# EAGLE design BMC1 (EAGLE 7.6.0)
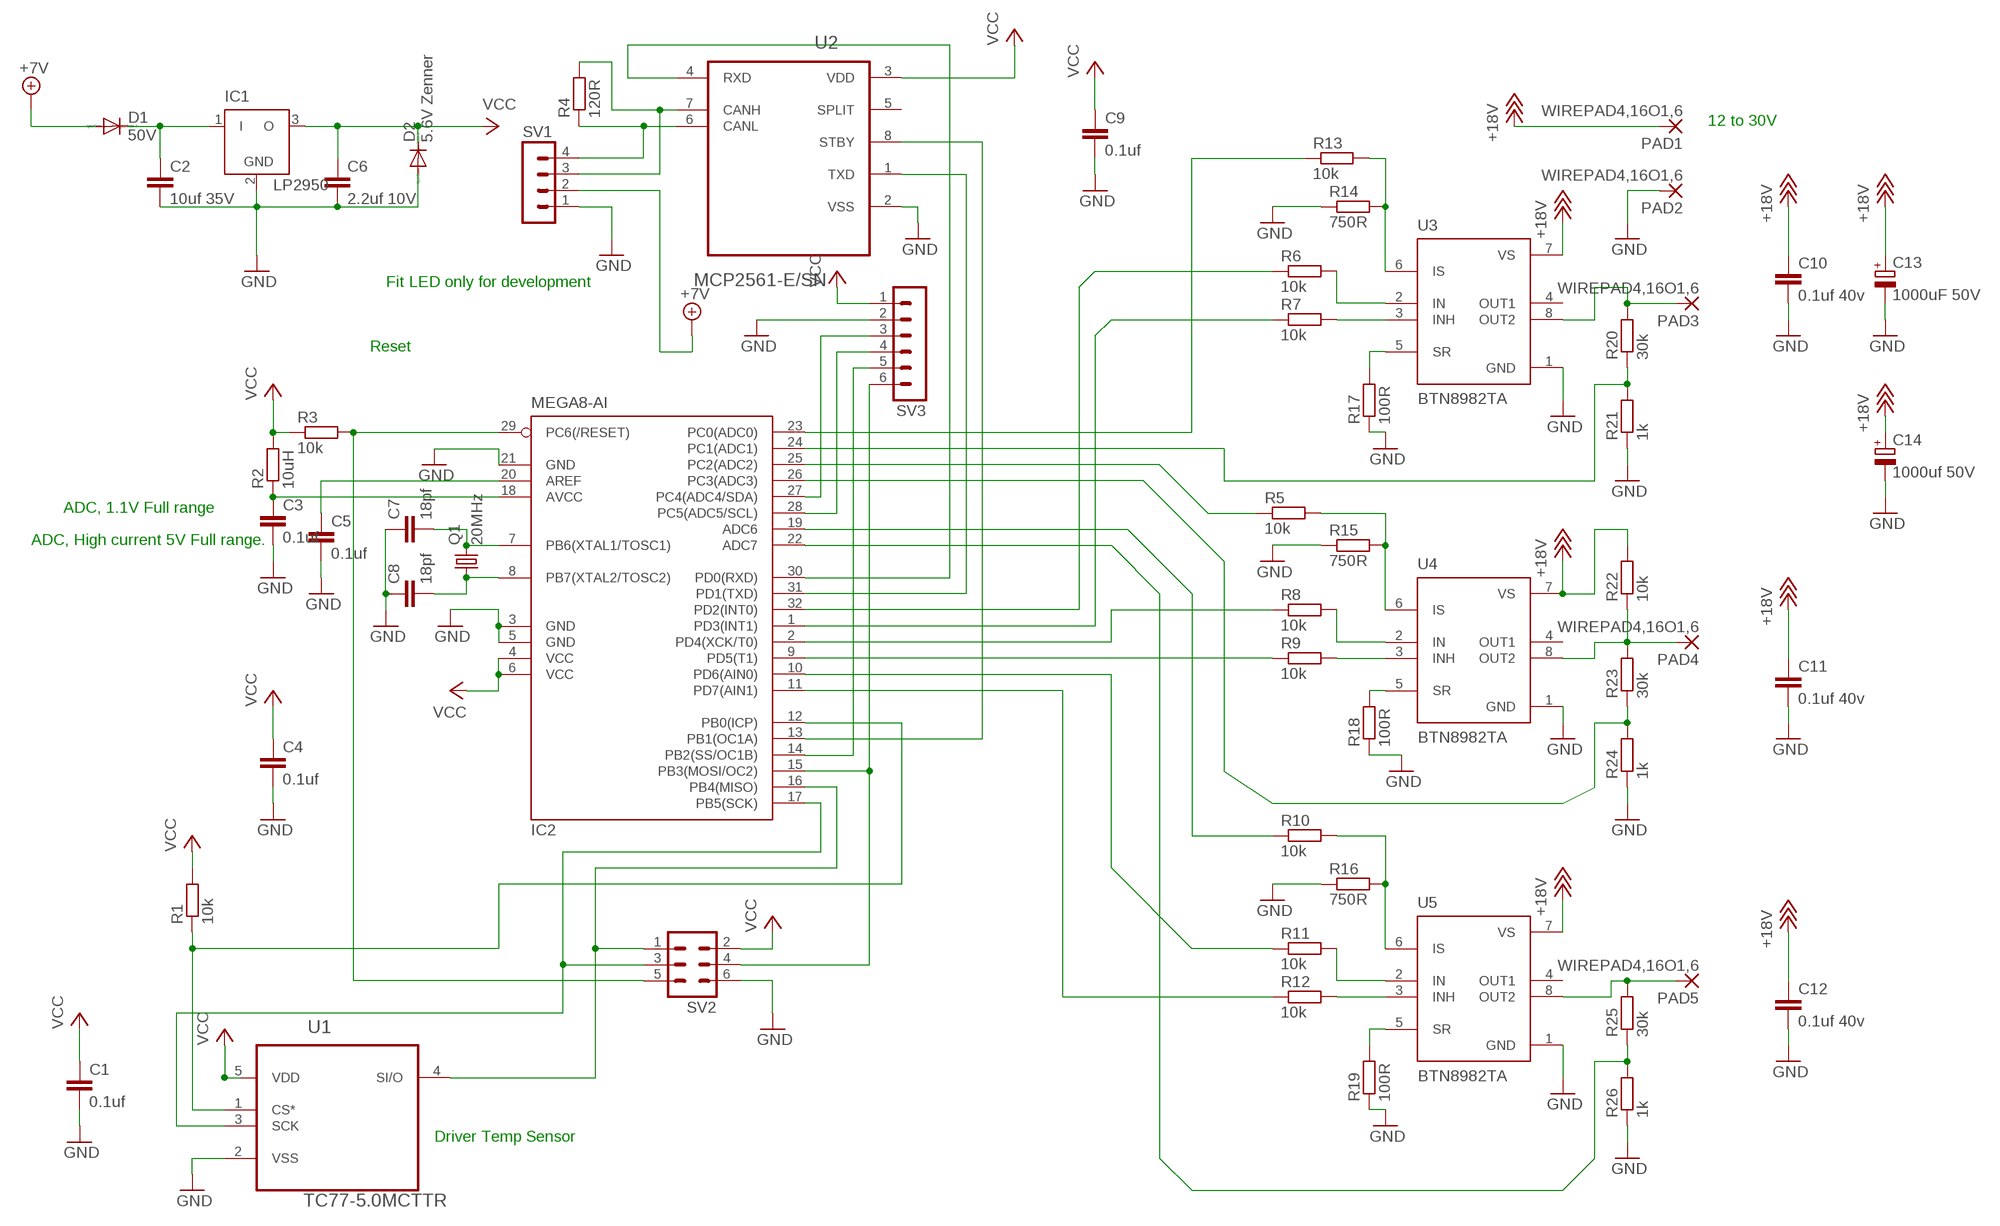
[diagram p0: schematic, sheet 1]

## Parts
C1  0.1uf  C-EUC0805  [C0805]
C2  10uf 35V  C-EUC0805  [C0805]
C3  0.1uf  C-EUC0805  [C0805]
C4  0.1uf  C-EUC0805  [C0805]
C5  0.1uf  C-EUC0805  [C0805]
C6  2.2uf 10V  C-EUC0805  [C0805]
C7  18pf  C-EUC0805  [C0805]
C8  18pf  C-EUC0805  [C0805]
C9  0.1uf  C-EUC0805  [C0805]
C10  0.1uf 40v  C-EUC0805  [C0805]
C11  0.1uf 40v  C-EUC0805  [C0805]
C12  0.1uf 40v  C-EUC0805  [C0805]
C13  1000uF 50V  CPOL-EUUD-10X10  [UD-10X10_NICHICON]
C14  1000uf 50V  CPOL-EUE5-10.5  [E5-10,5]
D1  50V  DIODE-SMB  [SMB]
D2  5.6V Zenner  DIODE-DO214AA  [DO214AA]
IC1  LP2950  [DPACK]
IC2  MEGA8-AI  [TQFP32-08]
PAD1  WIREPAD4,16O1,6  [4,16O1,6]
PAD2  WIREPAD4,16O1,6  [4,16O1,6]
PAD3  WIREPAD4,16O1,6  [4,16O1,6]
PAD4  WIREPAD4,16O1,6  [4,16O1,6]
PAD5  WIREPAD4,16O1,6  [4,16O1,6]
Q1  20MHz  CRYSTALHC49S  [HC49/S]
R1  10k  R-EU_R0805  [R0805]
R2  10uH  R-EU_R0805  [R0805]
R3  10k  R-EU_R0805  [R0805]
R4  120R  R-EU_R0805  [R0805]
R5  10k  R-EU_R0805  [R0805]
R6  10k  R-EU_R0805  [R0805]
R7  10k  R-EU_R0805  [R0805]
R8  10k  R-EU_R0805  [R0805]
R9  10k  R-EU_R0805  [R0805]
R10  10k  R-EU_R0805  [R0805]
R11  10k  R-EU_R0805  [R0805]
R12  10k  R-EU_R0805  [R0805]
R13  10k  R-EU_R0805  [R0805]
R14  750R  R-EU_R0805  [R0805]
R15  750R  R-EU_R0805  [R0805]
R16  750R  R-EU_R0805  [R0805]
R17  100R  R-EU_R0805  [R0805]
R18  100R  R-EU_R0805  [R0805]
R19  100R  R-EU_R0805  [R0805]
R20  30k  R-EU_R0805  [R0805]
R21  1k  R-EU_R0805  [R0805]
R22  10k  R-EU_R0805  [R0805]
R23  30k  R-EU_R0805  [R0805]
R24  1k  R-EU_R0805  [R0805]
R25  30k  R-EU_R0805  [R0805]
R26  1k  R-EU_R0805  [R0805]
SV1  MA04-1  [MA04-1]
SV2  MA03-2  [MA03-2]
SV3  MA06-1  [MA06-1]
U1  TC77-5.0MCTTR  [SOT95P290X145-5N]
U2  MCP2561-E/SN  [SOIC127P600X175-8N]
U3  BTN8982TA  [TO127P1500X440-8N-1]
U4  BTN8982TA  [TO127P1500X440-8N-1]
U5  BTN8982TA  [TO127P1500X440-8N-1]

## Nets
18V [power]: C10.1 C11.1 C12.1 C13.+ C14.+ PAD1.1(P) R22.2 U3.7(VS) U4.7(VS) U5.7(VS) ; supply symbol labelled +18V
+7V [supply]: D1.A SV1.2
GND [supply]: C1.2 C2.2 C3.2 C4.2 C5.2 C6.2 C7.1 C8.1 C9.2 C10.2 C11.2 C12.2 C13.- C14.- D2.A IC1.2(GND) IC2.3(GND) IC2.5(GND) IC2.21(GND) PAD2.1(P) R14.1 R15.1 R16.1 R17.1 R18.1 R19.1 R21.1 R24.1 R26.1 SV1.1 SV2.6 SV3.2 U1.2(VSS) U2.2(VSS) U3.1(GND) U4.1(GND) U5.1(GND)
N$1: R17.2 U3.5(SR)
N$2 [power]: PAD3.1(P) R20.2 U3.8(OUT2)
N$3: R7.2 U3.3(INH)
N$4: R6.2 U3.2(IN)
N$5: IC2.24(PC1(ADC1)) R20.1 R21.2
N$6: IC2.16(PB4(MISO)) SV2.1 U1.4(SI/O)
N$7 [power]: PAD4.1(P) R22.1 R23.2 U4.8(OUT2)
N$8: R18.2 U4.5(SR)
N$9: R9.2 U4.3(INH)
N$10: R8.2 U4.2(IN)
N$11: IC2.25(PC2(ADC2)) R5.1
N$12: IC2.2(PD4(XCK/T0)) R8.1
N$13 [power]: PAD5.1(P) R25.2 U5.8(OUT2)
N$14: R19.2 U5.5(SR)
N$15: R12.2 U5.3(INH)
N$16: R11.2 U5.2(IN)
N$17: IC2.19(ADC6) R10.1
N$18: IC2.22(ADC7) R25.1 R26.2
N$19: R4.1 SV1.4 U2.6(CANL)
N$21: IC2.9(PD5(T1)) R9.1
N$22: IC2.26(PC3(ADC3)) R23.1 R24.2
N$23: R4.2 SV1.3 U2.7(CANH)
N$25: IC2.13(PB1(OC1A)) U2.8(STBY)
N$26 [supply]: C2.1 D1.C IC1.1(I)
N$27: C7.2 IC2.7(PB6(XTAL1/TOSC1)) Q1.2
N$31: C8.2 IC2.8(PB7(XTAL2/TOSC2)) Q1.1
N$32: IC2.15(PB3(MOSI/OC2)) SV2.4 SV3.6
N$33: IC2.32(PD2(INT0)) R6.1
N$34: IC2.17(PB5(SCK)) SV2.3 U1.3(SCK)
N$36: R5.2 R15.2 U4.6(IS)
N$37: IC2.27(PC4(ADC4/SDA)) SV3.3
N$38: R13.2 R14.2 U3.6(IS)
N$39: R10.2 R16.2 U5.6(IS)
N$40: C3.1 IC2.18(AVCC) R2.1
N$41: IC2.28(PC5(ADC5/SCL)) SV3.4
N$42: IC2.30(PD0(RXD)) U2.4(RXD)
N$43: IC2.31(PD1(TXD)) U2.1(TXD)
N$44: IC2.11(PD7(AIN1)) R12.1
N$45: IC2.10(PD6(AIN0)) R11.1
N$46: IC2.1(PD3(INT1)) R7.1
N$49: IC2.14(PB2(SS/OC1B)) SV3.5
N$50: IC2.12(PB0(ICP)) R1.1 U1.1(CS*)
N$52: IC2.29(PC6(/RESET)) R3.2 SV2.5
N$54: C5.1 IC2.20(AREF)
N$55: IC2.23(PC0(ADC0)) R13.1
VCC [supply]: C1.1 C4.1 C6.1 C9.1 D2.C IC1.3(O) IC2.4(VCC) IC2.6(VCC) R1.2 R2.2 R3.1 SV2.2 SV3.1 U1.5(VDD) U2.3(VDD)
Unconnected: U2.5(SPLIT) U3.4(OUT1) U4.4(OUT1) U5.4(OUT1)

## Notes on the sheet
- 12 to 30V
- Fit LED only for development
- Reset
- ADC, 1.1V Full range
- ADC, High current 5V Full range.
- Driver Temp Sensor

## Library data of the parts
C1 C4 C9-C12 = rcl:C-EU: CAPACITOR, European symbol; MF: KEMET; MPN: C0805C104J5RACTU; OC_FARNELL: 1414663
C2 = rcl:C-EU: CAPACITOR, European symbol; MF: MURATA; MPN: GRM32ER7YA106KA12L; OC_FARNELL: 1735537
C3 C5 = rcl:C-EU: CAPACITOR, European symbol; MF: WALSIN; MPN: 0805B104K500CT; OC_FARNELL: 2496944
C6 = rcl:C-EU: CAPACITOR, European symbol; MF: KEMET; MPN: C0805C225K8RACAUTO; OC_FARNELL: 2478259
C7 C8 = rcl:C-EU: CAPACITOR, European symbol; MF: WALSIN; MPN: 0805N180J500CT; OC_FARNELL: 2497020
C13 = rcl:CPOL-EU: POLARIZED CAPACITOR, European symbol; MF: KEMET; MPN: T491A105K016AT; OC_FARNELL: 1457406
C14 = resistor:CPOL-EU: POLARIZED CAPACITOR, European symbol
D1 = diode:DIODE-: DIODE; MF: FAIRCHILD SEMICONDUCTOR; MPN: GF1A; OC_FARNELL: 1467476
D2 = diode:DIODE-: DIODE; MF: ON SEMICONDUCTOR; MPN: 1SMB5919BT3G; OC_FARNELL: 1431162
IC1 = linear:LP2950: 100 mA, Low Power Low Dropout Voltage Regulator Source: http://www.onsemi.com/pub/Collateral/LP2950-D.PDF; MF: ON SEMICONDUCTOR; MPN: LP2950CDT-5.0G; OC_FARNELL: 1468707
IC2 = atmel:MEGA8: MICROCONTROLLER 8 Kbytes FLASH, 1 kbytes SRAM, 512 bytes EEPROM, USART, 6-channel 10 bit ADC, 2-channel 8 bit ADC Pin compatible with Atmega48, ATMega88, ATMega168 Source: avr.lbr; MF: ATMEL; MPN: ATMEGA8-16AU; OC_FARNELL: 9171371; OC_NEWARK: 73M8863
PAD1-PAD5 = wirepad:WIREPAD: Wire PAD connect wire on PCB; OC_FARNELL: unknown
Q1 = crystal:CRYSTAL: CRYSTAL; MF: MULTICOMP; MPN: HC49SM-3.6864-30-50-60-16-ATF; OC_FARNELL: 1667008; OC_NEWARK: unknown
R1 R3 R5-R13 R22 = resistor:R-EU_: RESISTOR, European symbol; MF: WELWYN; MPN: WCR0805-10KFI; OC_FARNELL: 1099807
R2 = resistor:R-EU_: RESISTOR, European symbol; MF: TAIYO YUDEN; MPN: LB2012T100KR; OC_FARNELL: 1463501
R4 R14-R16 = resistor:R-EU_: RESISTOR, European symbol; MF: VISHAY; MPN: CRCW0805750RFKEA; OC_FARNELL: 1469956
R17-R19 = resistor:R-EU_: RESISTOR, European symbol; MF: WELWYN; MPN: WCR0805-100RFI; OC_FARNELL: 1099793
R20 R23 R25 = resistor:R-EU_: RESISTOR, European symbol; MF: VISHAY; MPN: CRCW080530K0FKEA; OC_FARNELL: 1469914
R21 R24 R26 = resistor:R-EU_: RESISTOR, European symbol; MF: VISHAY; MPN: CRCW08051K00FKEA; OC_FARNELL: 1469847
SV1 = con-lstb:MA04-1: PIN HEADER; OC_FARNELL: unknown; OC_NEWARK: unknown
SV2 = con-lstb:MA03-2: PIN HEADER; OC_FARNELL: unknown; OC_NEWARK: unknown
SV3 = con-lstb:MA06-1: PIN HEADER; OC_FARNELL: unknown; OC_NEWARK: unknown
U1 = temp-tc77-5v:TC77-5.0MCTTR: IC,Thermal Sensor with SPI Interface ,5.0V, SOT23-5; MF: MICROCHIP; MPN: TC77-5.0MCTTR; OC_FARNELL: 1292291; OC_NEWARK: 96K4049; PACKAGE: SOT23-5; SUPPLIER: Microchip
U2 = Microchip-MCP2561-E_SN:MCP2561-E/SN: High-Speed CAN Transceiver,SOIC-8; MPN: MCP2561-E/SN; OC_FARNELL: 2362837; OC_NEWARK: 12X8698; PACKAGE: SOIC-8; SUPPLIER: Microchip
U3-U5 = BTN8982TA:BTN8982TA: BTN8982TA High Current PN Half Bridge NovalithIC TO127P1500X440-8N-1; MF: INFINEON; MPN: BTN8982TA; OC_FARNELL: 2470127

## Net classes
0 default: width 0.203 mm, clearance 0.203 mm
1 supply: width 0.305 mm
2 power: width 0.914 mm, clearance 0.406 mm

## Board
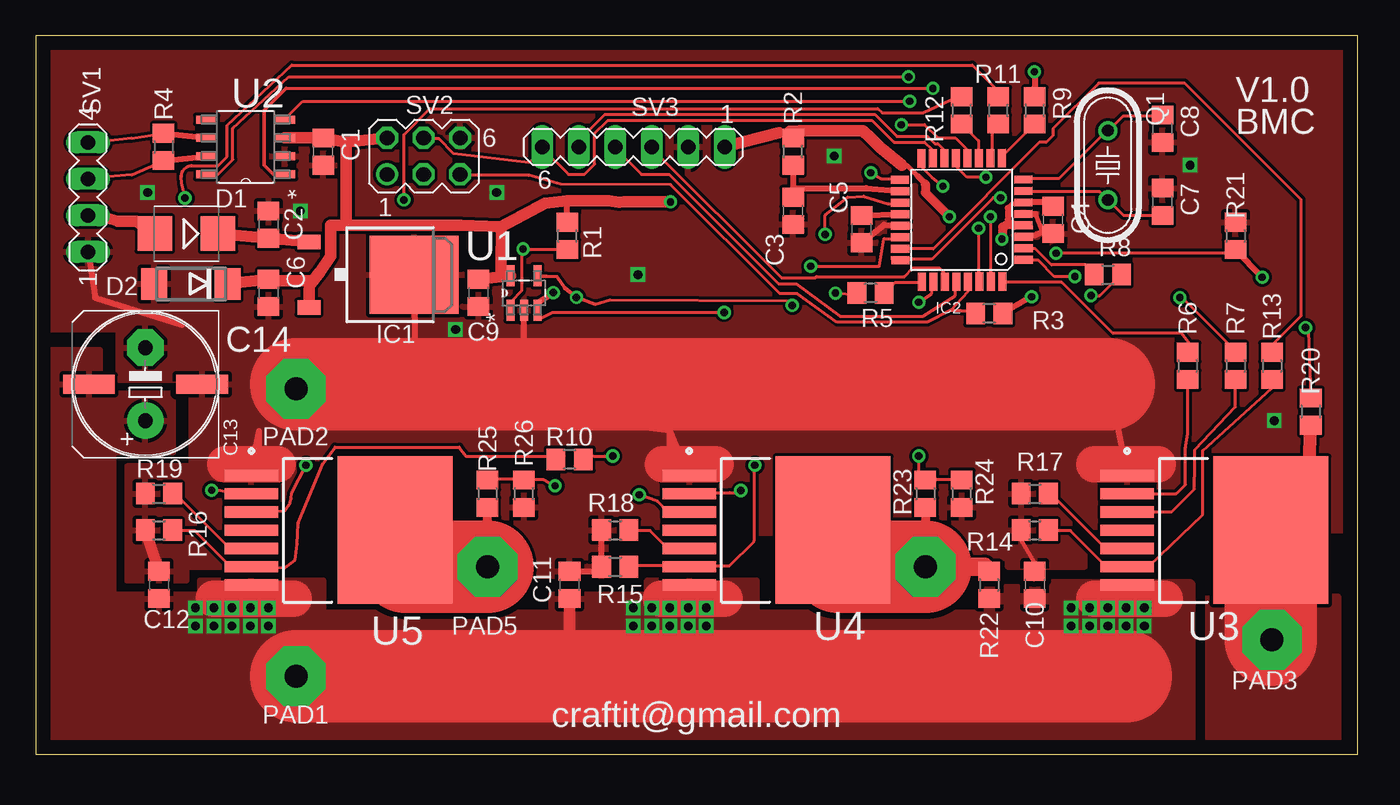
[diagram p1: board, top side]
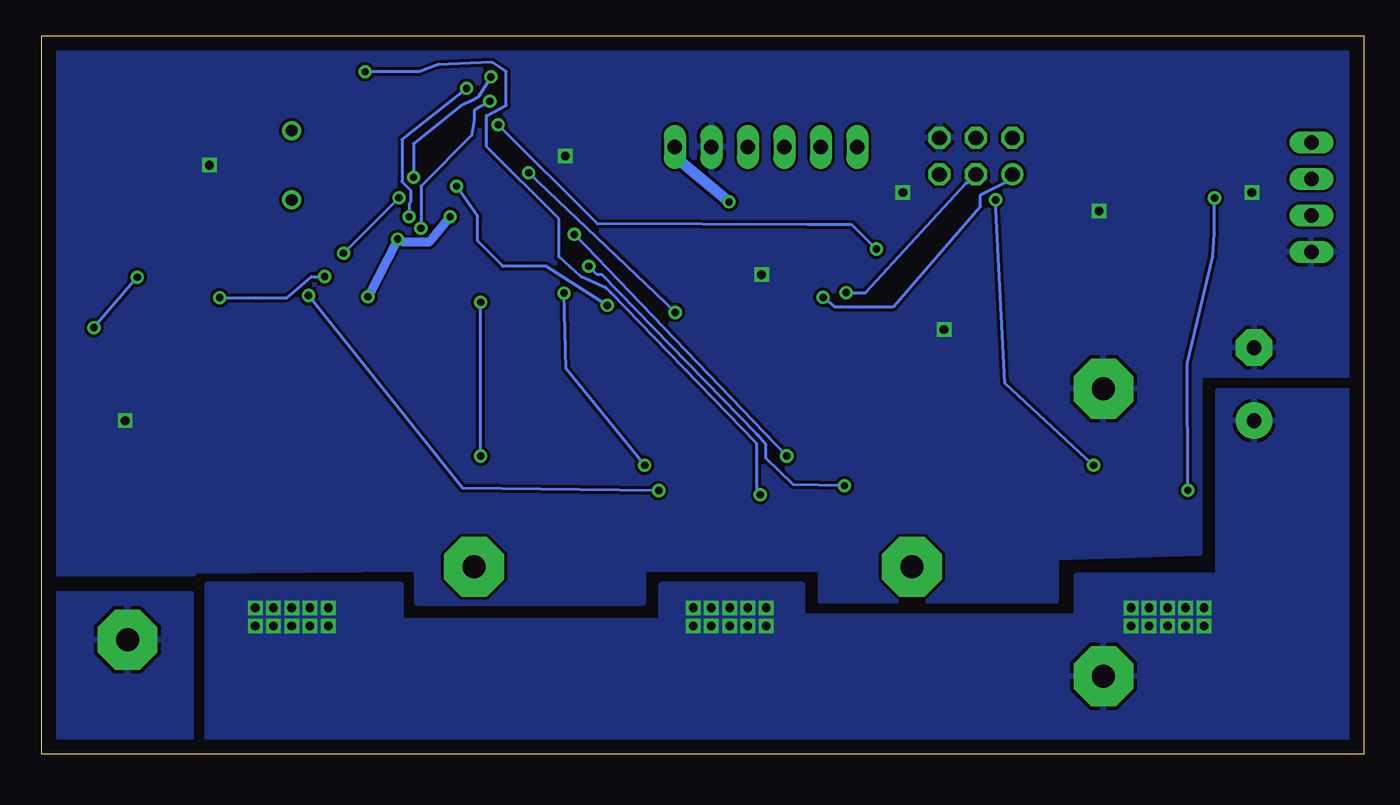
[diagram p2: board, bottom side, seen from below]

Size 92 x 50 mm. Coordinates in mm from the lower left corner, seen from the top.
Outline: 0,0 92,0 92,50 0,50 0,0
Copper layers (1*16): Top 0.035mm / dielectric 1.5mm / Bottom 0.035mm
Design rules "default *": minimum track width 8mil, minimum drill 20mil, track to track 8mil, track to pad 8mil, pad to pad 8mil, via to via 8mil, smd to smd 8mil, copper to edge 40mil, drill to drill 8mil, minimum pad ring 10mil, minimum via ring 8mil, stop-mask expansion 4mil, vias tented up to drill 0mil, thermal gap 10mil

### Footprints (pad centres in the part's own frame; a part is rotated, then mirrored left to right if it is on the bottom)
C0805 = smd 1.3 x 1.5: 1 -0.95,0; 2 0.95,0
UD-10X10_NICHICON = smd 3.6 x 1.3: + 3.925,0; - -3.95,0
E5-10,5 = drill 1.016 pad 2.54: + -2.54,0 | drill 1.016 pad 2.54 octagon: - 2.54,0
SMB = smd 2.4 x 2.4: A 2.2,0; C -2.2,0
DO214AA = smd 1.8 x 2.2: A 2.55,0; C -2.55,0
DPACK = smd 1 x 1.6: 1 -2.28,-4.8; 3 2.28,-4.8 | smd 5.4 x 6.2: 2 0,2.5
TQFP32-08 = smd 1.27 x 0.559: 1 -4.293,2.8; 2 -4.293,2; 3 -4.293,1.2; 4 -4.293,0.4; 5 -4.293,-0.4; 6 -4.293,-1.2; 7 -4.293,-2; 8 -4.293,-2.8; 17 4.293,-2.8; 18 4.293,-2; 19 4.293,-1.2; 20 4.293,-0.4; 21 4.293,0.4; 22 4.293,1.2; 23 4.293,2; 24 4.293,2.8 | smd 0.559 x 1.27: 9 -2.8,-4.293; 10 -2,-4.293; 11 -1.2,-4.293; 12 -0.4,-4.293; 13 0.4,-4.293; 14 1.2,-4.293; 15 2,-4.293; 16 2.8,-4.293; 25 2.8,4.293; 26 2,4.293; 27 1.2,4.293; 28 0.4,4.293; 29 -0.4,4.293; 30 -1.2,4.293; 31 -2,4.293; 32 -2.8,4.293
4,16O1,6 = drill 1.6 pad 4.166 octagon: 1 0,0
HC49/S = drill 0.813: 1 -2.413,0; 2 2.413,0
R0805 = smd 1.3 x 1.5: 1 -0.95,0; 2 0.95,0
MA04-1 = drill 1.016 long: 1 -3.81,0; 2 -1.27,0; 3 1.27,0; 4 3.81,0
MA03-2 = drill 1.016: 1 -2.54,-1.27 | drill 1.016 octagon: 2 -2.54,1.27; 3 0,-1.27; 4 0,1.27; 5 2.54,-1.27; 6 2.54,1.27
MA06-1 = drill 1.016 long: 1 -6.35,0; 2 -3.81,0; 3 -1.27,0; 4 1.27,0; 5 3.81,0; 6 6.35,0
SOT95P290X145-5N = smd 1.473 x 0.559: 1 -1.194,0.94; 2 -1.194,0; 3 -1.194,-0.94; 4 1.194,-0.94; 5 1.194,0.94
SOIC127P600X175-8N = smd 1.473 x 0.559: 1 -2.718,1.905; 2 -2.718,0.635; 3 -2.718,-0.635; 4 -2.718,-1.905; 5 2.718,-1.905; 6 2.718,-0.635; 7 2.718,0.635; 8 2.718,1.905
TO127P1500X440-8N-1 = smd 3.708 x 0.787: 1 -5.004,3.81; 2 -5.004,2.54; 3 -5.004,1.27; 4 -5.004,0; 5 -5.004,-1.27; 6 -5.004,-2.54; 7 -5.004,-3.81 | smd 8.001 x 10.262: 8 5.004,0

### Placement (x,y rotation side)
C1  20,41.96 270 top
C2  16.19,36.88 90 top
C3  52.7,37.83 270 top
C4  70.8,37.2 270 top
C5  57.47,36.56 270 top
C6  16.19,32.12 270 top
C7  78.42,38.47 270 top
C8  78.42,43.55 90 top
C9  30.8,32.12 270 top
C10  69.53,11.79 90 top
C11  37.15,11.79 90 top
C12  8.57,11.79 90 top
C13  7.62,25.77 180 top
C14  7.62,25.77 90 top
D1  10.48,36.24 180 top
D2  10.79,32.75 180 top
IC1  23.81,33.38 270 top
IC2  64.45,37.2 180.2 top
PAD1  18.1,5.45 180 top
PAD2  18.1,25.45 180 top
PAD3  86.04,7.99 180 top
PAD4  61.91,13.06 180 top
PAD5  31.43,13.06 180 top
Q1  74.61,41.01 270 top
R1  36.99,36.08 90 top
R2  52.7,41.96 90 top
R3  66.36,30.69 180 top
R4  8.89,42.27 270 top
R5  58.1,32.12 180 top
R6  80.17,27.04 270 top
R7  83.5,27.04 270 top
R8  74.61,33.38 0 top
R9  69.53,44.81 90 top
R10  37.15,20.53 180 top
R11  66.99,44.81 90 top
R12  64.45,44.81 90 top
R13  86.04,27.04 270 top
R14  69.53,15.61 0 top
R15  40.32,13.06 0 top
R16  8.57,15.61 0 top
R17  69.53,18.14 0 top
R18  40.32,15.61 0 top
R19  8.57,18.14 0 top
R20  88.74,23.86 270 top
R21  83.5,36.08 270 top
R22  66.36,11.79 270 top
R23  61.91,18.14 270 top
R24  64.45,18.14 90 top
R25  31.43,18.14 270 top
R26  33.97,18.14 90 top
SV1  3.63,38.78 90 top
SV2  26.99,41.64 0 top
SV3  41.59,42.27 180 top
U1  33.97,32.12 90 top
U2  14.61,42.27 180 top
U3  80.96,15.61 0 top
U4  50.48,15.61 0 top
U5  20,15.61 0 top

### Tracks (layer width: path | path; a pad name or v marks a point on that pad's centre or on a via)
18V  (via drill 0.6)
  Top 0.406: U3.7 78.42,11.79
  Top 0.813: C11.1 37.15,5.45
  Top 2.54: 12.38,10.84 17.94,10.84 | 43.5,10.84 47.94,10.84 | 73.66,10.84 78.58,10.84
  Top 6.452: PAD1.1 37.15,5.45 75.88,5.45
  other vias: 11.11,10.21 12.38,10.21 13.65,10.21 14.92,10.21 16.19,10.21 11.11,8.94 12.38,8.94 13.65,8.94 14.92,8.94 16.19,8.94 46.67,10.21 42.86,10.21 44.13,10.21 42.86,8.94 46.67,8.94 44.13,8.94 45.4,10.21 72.07,10.21 72.07,8.94 73.34,10.21 73.34,8.94 74.61,10.21 74.61,8.94 75.88,10.21 75.88,8.94 77.15,10.21 77.15,8.94 45.4,8.94 41.59,10.21 41.59,8.94
  pour Top: -6.65,28.15 4.45,28.15 4.45,25.13 9.53,25.13 9.53,21 5.4,21 5.4,11.16 11.43,11.16 11.43,12.11 20,12.11 20,9.89 80.49,9.89 80.49,-2.39 -6.65,-2.39
  pour Bottom: -6.65,25.29 10.16,25.29 10.16,12.43 20,12.43 20,9.57 39.05,9.57 39.05,11.79 48.9,11.79 48.9,9.26 66.99,9.26 66.99,11.79 80.49,11.79 80.49,-2.23 -6.33,-2.39
  pour Top: 42.55,12.11 50.16,12.11 50.16,7.99 35.88,7.99 35.88,11.16 42.55,11.16
  pour Top: 66.36,2.27 66.36,11.48 70.8,11.48 70.8,11.79 80.33,11.79 80.33,2.27
+7V
  Top 0.305: 4.18,37.59 SV1.2
  Top 0.813: 4.18,37.59 5.69,37.1 6.97,37.1 D1.A
GND  (via drill 0.6)
  Top 0.305: 7.07,15.48 R16.1 | R15.1 39.41,13.14 39.37,13.14 | C10.2 69.48,12.2 69.48,13.39 68.57,14.95 R14.1 | 69.48,36.1 68.77,36.1 IC2.3 | C4.2 70.57,36.4 70.05,36.36 69.58,37.61
  Top 0.406: 74.69,25.77 U3.1 | U5.1 14.92,19.41 15.54,22.5 15.54,20.05 16.67,20.05 16.83,20.21 | U4.1 45.4,19.41 44.15,22.54 | 44.15,22.54 18.1,25.77 | C11.2 39.37,12.74 R15.1 39.37,13.14 R18.1 | IC1.2 26.35,33.38 26.35,27.04 33.97,27.04 U1.2 | SV1.1 4.13,31.8 10.16,29.89 | 70.05,36.36 69.48,36.1 | C5.2 59.05,36.88 IC2.21 | IC2.5 69.58,37.61 | 43.66,20.21 44.15,20.21 44.15,22.54
  Top 0.813: R16.1 C12.2
  Top 2.54: 13.18,20.21 16.83,20.21 | 43.66,20.21 47.31,20.21 | 73.66,20.21 78.11,20.21
  Top 6.452: 18.1,25.77 74.69,25.77
  other vias: 32.07,39.1 55.56,41.64 41.91,33.38 29.21,29.57 18.41,37.83 80.33,41.01 7.78,39.1 86.2,23.23
  pour Top: -6.67,29.57 5.71,29.57 5.71,26.08 10.79,26.08 10.79,20.05 6.35,20.05 6.35,12.11 10.48,12.11 10.48,13.06 21.27,13.06 21.27,15.92 32.7,15.92 32.7,12.43 39.69,12.43 39.69,15.29 66.04,15.61 96.97,15.61 97.47,59.42 -6.67,59.42
  pour Bottom: -6.67,26.4 11.43,26.4 11.43,14.02 21.43,13.7 21.43,10.68 37.78,10.68 37.78,12.91 50.16,12.91 50.16,10.53 65.88,10.53 65.88,12.91 81.44,12.75 81.44,12.59 94.14,12.59 93.98,2.27 96.84,2.11 96.84,13.7 97.47,59.42 -6.67,59.42
  pour Top: 64.45,15.61 64.45,13.7 67.63,13.7 67.63,13.06 73.03,13.06 73.03,15.29 69.53,15.29 69.53,15.61
N$1
  Top 0.203: R17.2 70.5,18.12 70.7,18.12 74.46,14.36 75.88,14.36 U3.5
N$2
  Top 0.406: PAD3.1 85.97,7.99
  Top 0.914: R20.2 88.58,18.22 U3.8 85.53,15.48 82.59,12.53
  Top 6.452: 85.97,7.99 U3.8
  pour Bottom: 81.6,11.16 91.44,11.16 91.28,-1.34 81.6,-1.34
  pour Top: 81.6,11 90.65,11 90.65,-1.39 81.6,-1.39
N$3
  Top 0.203: R7.2 83.5,24.2 80.66,21.19 80.66,20.15 80.64,18.46 79.06,16.88 77.43,16.88 77.41,16.9 75.98,16.9 U3.3
N$4
  Top 0.203: R6.2 80.17,22.31 80.01,21.32 80.01,18.78 79.38,18.14 77.58,18.14 77.51,18.22 75.98,18.22 U3.2
N$5  (via drill 0.51)
  Top 0.203: v67.14,38.74 66.64,38.74 62.37,34.48 60.24,34.48 IC2.24 | 83.6,34.88 83.5,34.88 v71.01,34.88 | R20.1 88.58,29.5 v88.38,29.7
  Top 0.406: v85.36,33.2 R21.2 83.5,34.88
  Bottom 0.203: v71.01,34.88 v67.14,38.74 | v85.36,33.2 v88.38,29.7
N$6  (via drill 0.51)
  Top 0.203: v63.14,39.54 62.37,40.17 61.66,40.88 61.66,41.39 IC2.16 | v52.65,31.25 52.28,31.57 39.97,31.64 38.93,31.32 | 35.06,33.26 36.26,33.26 U1.4
  Top 0.254: 36.26,33.26 36.83,32.43 | 38.93,31.32 v37.62,31.8
  Top 0.305: v37.62,31.8 36.83,32.43
  Bottom 0.203: v52.65,31.25 56.89,33.97 59.91,33.97 61.66,35.73 61.66,37.44 v63.14,39.54 | v37.62,31.8 36.82,31.16 36.35,31.16 32.73,31.17 26.67,38.15 26.67,38.94 24.8,39.89 24.8,39.99 24.5,40.29 SV2.1
N$7
  Top 0.61: 66.04,13.06 R22.1 | R23.2 PAD4.1
  Top 1.27: U4.8 55.88,15.61 | PAD4.1 66.04,13.06
  Top 6.452: 55.88,15.61 55.88,13.06 PAD4.1
N$8
  Top 0.203: R18.2 41.34,15.58 42.76,15.58 43.98,14.36 45.4,14.36 U4.5
N$9  (via drill 0.51)
  Top 0.203: 69.41,46.49 69.48,45.86 R9.2 | v69.51,47.51 69.66,47.51 | v42,18.07 43.27,17.61 43.98,16.9 45.4,16.9 U4.3
  Top 0.406: v69.51,47.51 69.53,47.51 R9.2
  Bottom 0.203: v69.51,47.51 65.72,47.51 64.45,47.99 60.64,48.17 59.69,47.53 59.69,45.17 61.05,44.45 61.05,42.3 56.02,37.27 56.02,34.63 54.46,33.23 52.7,32.43 52.39,32.12 42.23,21.64 42.23,18.3 v42,18.07
N$10  (via drill 0.51)
  Top 0.203: v73.44,31.94 74.05,31.94 75.48,33.36 R8.2 | v49.07,18.37 48.76,18.21 48.3,18.22 45.5,18.22 U4.2
  Bottom 0.203: v73.44,31.94 62.73,18.53 v49.07,18.37
N$11
  Top 0.203: IC2.25 61.66,32.85 59.83,32.85 59.12,32.14 R5.1
N$12
  Top 0.203: IC2.2 68.77,35.19 69.58,35.19 70.7,34.07 73.04,34.07 73.65,33.46 R8.1
N$13
  Top 0.406: 26,16.6 26.04,16.6
  Top 0.61: PAD5.1 R25.2
  Top 0.914: U5.8 26,16.6
  Top 1.27: 26.04,16.6 25.72,13.06
  Top 6.452: 25.72,13.06 PAD5.1
N$14
  Top 0.203: R19.2 9.54,18.12 9.74,18.12 13.5,14.36 14.92,14.36 U5.5
N$15  (via drill 0.51)
  Top 0.203: v25.62,38.59 25.62,43.14 27.42,44.94 58.61,44.94 58.91,44.64 61.76,44.64 64.15,45.76 64.4,45.76 R12.2 | v18.8,20.13 17.79,18.18 17.78,17.83 17.69,17.51 17.32,16.98 16.45,16.9 15.02,16.9 U5.3
  Bottom 0.203: v25.62,38.59 24.98,25.84 v18.8,20.13
N$16  (via drill 0.51)
  Top 0.203: v10.38,38.72 10.13,39.75 10.12,40.2 arc-92 10.88,40.98 12.68,40.98 13.3,41.6 13.3,43.77 17.8,47.97 65.18,47.97 67.28,45.86 66.94,45.86 R11.2 | v12.23,18.39 12.7,18.39 13.5,18.22 14.92,18.22 U5.2
  Bottom 0.203: v10.38,38.72 10.38,36.24 10.48,34.66 12.28,27.23 v12.23,18.39
N$17  (via drill 0.51)
  Top 0.203: v54.94,36.19 54.93,36.5 54.93,37.51 56.52,38.78 57.61,38.85 59.32,38.34 60.13,38.34 IC2.19 | v40.15,20.77 39.6,20.77 38.8,20.76 R10.1
  Bottom 0.203: v40.15,20.77 v54.94,36.19
N$18  (via drill 0.51)
  Top 0.203: v53.94,33.97 58.7,33.97 59.04,35.9 60.13,35.9 IC2.22 | v36.13,18.7 35.29,19.14 34.02,19.14 R26.2 33.92,19.14 31.48,19.14 R25.1
  Bottom 0.203: v36.13,18.7 39.69,18.78 41.59,20.61 41.59,21.56 42.23,22.27 53.02,33.38 53.35,33.38 v53.94,33.97
N$19
  Top 0.203: SV1.4 4.18,42.67 4.85,42.67 6.67,42.9 R4.1
  Top 0.406: R4.1 U2.6
N$21
  Top 0.203: IC2.9 67.25,41.59 69.48,43.82 R9.1
N$22  (via drill 0.51)
  Top 0.203: v61.45,31.47 62.37,32.06 62.37,32.85 IC2.26 | v61.45,20.77 61.45,19.54 61.86,19.14 R23.1 61.96,19.14 64.4,19.14 R24.2
  Bottom 0.203: v61.45,20.77 v61.45,31.47
N$23
  Top 0.203: SV1.3 4.18,40.13 4.24,40.13 6.67,40.33 R4.2
  Top 0.406: R4.2 U2.7
N$25  (via drill 0.51)
  Top 0.203: v66.13,40.17 64.81,40.17 64.1,40.88 64.1,41.39 IC2.13 | v60.74,47.15 17.6,47.15 13.7,43.57 13.7,41.4 12.68,40.37 U2.8
  Bottom 0.203: v66.13,40.17 66.13,42.5 62.9,45.09 61.95,45.55 61.65,45.72 v60.74,47.15
N$26
  Top 0.305: 18.99,35.59 IC1.1
  Top 0.813: D1.C C2.1 IC1.1
N$27
  Top 0.203: IC2.7 68.77,39.15 74.05,39.15 Q1.2 75.68,37.52 C7.2
N$31
  Top 0.203: IC2.8 68.77,40.06 71.21,40.06 74.56,43.42 Q1.1 74.66,43.42 75.68,44.43 78.42,44.43 C8.2
N$32
  Top 0.203: IC2.15 62.37,41.49 62.37,42.1 61.86,42.6 59.73,42.6 58.2,44.13 39.81,44.13 38.9,43.22 38.9,41.08 38.19,40.37 37.07,40.37 35.24,42.2 SV3.6 35.24,42.1 34.33,41.18 29.07,41.82 28.05,42.83 27.04,42.83 SV2.4
N$33
  Top 0.203: IC2.32 67.35,32.85 71.41,32.85 74.97,29.3 79.74,29.3 80.33,28.55 R6.1
N$34  (via drill 0.51)
  Top 0.203: v58.12,40.48 58.85,40.06 60.13,40.06 IC2.17 | v47.91,30.76 35.95,30.76 34.99,30.29 U1.3 35.09,30.92 35.06,31.53
  Top 0.406: 35.06,31.53 v36.02,32.14
  Bottom 0.203: v47.91,30.76 v58.12,40.48 | v36.02,32.14 34.66,32.14 27.65,39.79 27.55,39.79 27.04,40.29 SV2.3
N$36  (via drill 0.51)
  Top 0.203: R15.2 41.34,13.14 45.4,13.14 U4.6 45.5,13.14 47.03,13.14 48.27,13.12 49.97,14.81 50.01,14.97 50.02,19.95 v50.04,20.13 | v55.66,32.1 57.09,32.04 R5.2
  Bottom 0.203: v55.66,32.1 55.5,26.86 v50.04,20.13
N$37
  Top 0.203: IC2.27 63.18,32.95 63.18,33.56 62.88,33.87 61.05,33.87 60.44,33.26 54.34,33.26 54.24,33.16 51.91,33.16 42.86,42.2 SV3.3
N$38
  Top 0.203: R14.2 70.5,15.58 72.02,15.58 74.46,13.14 75.88,13.14 U3.6 75.98,13.14 77.51,13.14 81.22,16.7 81.22,21.15 86.04,25.49 R13.2
N$39
  Top 0.203: R16.2 9.54,15.58 11.06,15.58 13.5,13.14 14.92,13.14 U5.6 15.02,13.14 17.34,12.98 18.04,13.52 18.2,14.64 18.26,16.08 20,20.25 20.82,21.38 29.46,21.38 29.93,20.76 36.77,20.76 R10.2
N$40
  Top 0.203: 59.5,39.25 IC2.18 | 53.02,39.46 C3.1
  Top 0.406: R2.1 C3.1 52.7,39.42 57.78,39.42 59.5,39.25
N$41
  Top 0.203: IC2.28 63.99,32.85 63.99,31.94 61.76,30.5 55.97,30.5 52.92,32.75 51.7,32.75 44.08,40.37 42.15,40.37 40.32,42.2 SV3.4
N$42  (via drill 0.51)
  Top 0.203: v65.62,36.61 65.62,32.95 IC2.30 | v60.82,45.45 18.57,45.45 17.35,44.23 U2.4
  Bottom 0.203: v65.62,36.61 65.62,39.56 62.09,43.09 61.91,44.18 61.91,44.81 v60.82,45.45
N$43  (via drill 0.51)
  Top 0.203: v66.43,37.42 66.43,32.95 IC2.31 | 17.41,46.35 v62.45,46.35
  Top 0.254: U2.1 16.51,40.37 15.88,41.01 15.88,44.81 17.41,46.35
  Bottom 0.203: v66.43,37.42 66.43,38.34 66.33,38.44 66.33,39.25 66.94,39.86 66.94,42.81 v62.45,46.35
N$44
  Top 0.203: IC2.11 65.62,41.59 65.62,42.71 64.5,43.82 R12.1
N$45
  Top 0.203: IC2.10 66.53,41.59 66.53,43.42 66.94,43.82 R11.1
N$46  (via drill 0.51)
  Top 0.203: v72.33,33.26 70.9,33.26 69.79,34.38 68.77,34.38 IC2.1 | v79.63,31.79 79.95,31.63 83.5,28.08 R7.1
  Bottom 0.203: v72.33,33.26 73.24,33.26 74.93,31.8 77.09,31.8 v79.63,31.79
N$49
  Top 0.203: SV3.5 37.78,42.71 39.61,44.54 58.41,44.54 59.93,43.01 62.06,43.01 62.57,42.5 62.78,42.5 63.18,42.1 63.18,41.49 IC2.14
N$50  (via drill 0.51)
  Top 0.203: v60.24,43.82 61.86,43.82 62.78,42.91 63.99,42.91 64.81,42.1 64.81,41.59 IC2.12 | 33.8,34.97 33.8,32.26 33.06,31.52 33.06,31.56 U1.1
  Top 0.254: 33.8,34.97 v33.91,35.17 R1.1
  Bottom 0.203: v60.24,43.82 53.33,36.92 38.73,36.88 35.62,36.88 v33.91,35.17
N$52
  Top 0.203: IC2.29 64.91,32.85 64.91,32.24 63.69,30.92 62.06,30.09 55.77,30.09 53,32.06 51.78,32.06 44.18,39.66 36.51,39.69 34.32,40.29 29.58,40.29 SV2.5
  Top 0.254: 63.69,30.92 65.09,30.84
  Top 0.406: 65.09,30.84 65.41,30.84 R3.2
N$54
  Top 0.406: C5.1 IC2.20
N$55
  Top 0.203: R13.1 86.04,28.48 88.08,30.52 88.08,38.62 79.97,46.72 73.98,46.72 70.8,43.55 70.8,43.07 70.33,42.59 69.85,42.59 62.47,35.19 60.24,35.19 IC2.23
VCC  (via drill 0.51)
  Top 0.305: 16.24,32.98 C6.1 | 18.99,31.12 IC1.3 | 24.4,42.83 SV2.2 | 70.6,38.44 70.8,38.24 C4.1 | 68.77,38.44 IC2.6 68.67,38.34 67.96,38.34 67.65,38.03 | 67.65,37.22 68.06,36.81 68.67,36.81 IC2.4 | 67.25,36 v67.25,35.86 | 51.74,43.25 R2.2 | 47.94,42.3 SV3.1 | 60.3,41.01 60.64,41.01 61.37,40.26
  Top 0.406: 70.6,38.44 68.77,38.44 | 67.65,38.03 67.65,37.22 | 61.37,40.26 61.91,39.71 | 33.03,33.06 U1.5 | 20.52,36.83 20.57,36.88 21.59,36.88 | v69.31,31.85 R3.1 | R1.2 36.99,38.52 | 20.07,42.9 C1.1 19.37,42.9
  Top 0.61: 68.06,36.81 67.63,36.88 67.31,36.7 67.25,36 | 61.91,39.71 61.91,39.1 v63.59,37.42
  Top 0.813: 19.04,32.98 16.24,32.98 | 18.99,31.12 19.04,32.98 | U2.3 18.38,42.91 19.37,42.9 19.95,42.9 | 19.04,32.98 19.14,32.76 19.77,33.6 20.52,34.67 20.52,36.83 29.55,36.83 32.37,36.71 | 47.94,42.3 51.74,43.25 | 32.37,36.71 35.45,38.36 36.99,38.52 39.87,38.52 40.6,38.43 40.93,38.45 v44.17,38.45 | 32.37,36.71 32.42,35.98 32.38,34.81 32.38,33.23 | 60.3,41.01 58.74,42.25 58.1,42.91 57.57,43.42 53.17,43.42 52.48,43.35 R2.2 | 21.59,36.88 21.59,42.59 | 21.59,42.59 20.07,42.9 C1.1 | 21.59,42.59 SV2.2 | D2.C C6.1 | C9.1 32.38,33.23 | 32.38,33.23 U1.5
  Bottom 0.61: v69.31,31.85 v67.25,35.86 66.83,35.65 65.05,35.65 v63.59,37.42 | 47.94,41.59 SV3.1
  Bottom 0.813: v44.17,38.45 47.94,41.59

### Text on the board
tNames: V1.0 | BMC | craftit@gmail.com